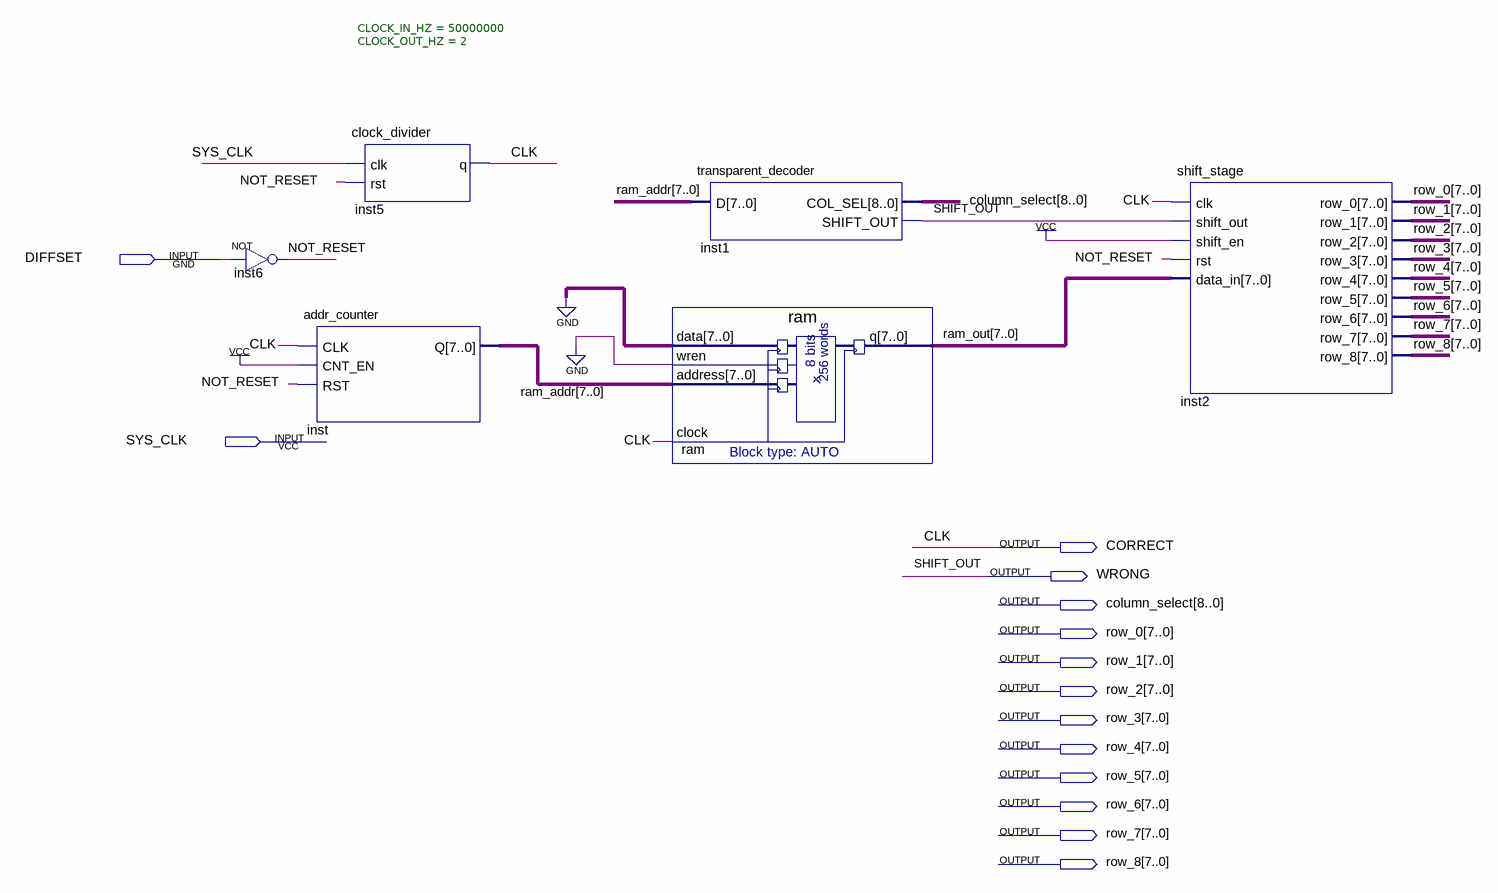
[diagram p0: schematic sheet]
// Quartus schematic test_ram_display.bdf as structural Verilog: 6 symbols, 14 pins
module test_ram_display (
  input  DIFFSET,
  input  SYS_CLK,
  output CORRECT,
  output WRONG,
  output [8:0] column_select,
  output [7:0] row_0,
  output [7:0] row_1,
  output [7:0] row_2,
  output [7:0] row_3,
  output [7:0] row_4,
  output [7:0] row_5,
  output [7:0] row_6,
  output [7:0] row_7,
  output [7:0] row_8
);

  wire NOT_RESET;
  wire [7:0] ram_addr, ram_out;

  not inst6 (NOT_RESET, DIFFSET);
  clock_divider #(.CLOCK_IN_HZ(50000000), .CLOCK_OUT_HZ(2)) inst5 (.clk(SYS_CLK), .rst(NOT_RESET), .q(CORRECT));
  addr_counter inst (.CLK(CORRECT), .CNT_EN(1'b1), .RST(NOT_RESET), .Q(ram_addr));
  transparent_decoder inst1 (.D(ram_addr), .COL_SEL(column_select), .SHIFT_OUT(WRONG));
  ram ram (.data({8{1'b0}}), .wren(1'b0), .address(ram_addr), .clock(CORRECT), .q(ram_out));
  shift_stage inst2 (
    .clk(CORRECT), .shift_out(WRONG), .shift_en(1'b1), .rst(NOT_RESET), .data_in(ram_out), .row_0(row_0),
    .row_1(row_1), .row_2(row_2), .row_3(row_3), .row_4(row_4), .row_5(row_5), .row_6(row_6), .row_7(row_7),
    .row_8(row_8));

  // Other names for the same wires on the sheet: CLK = CORRECT; SHIFT_OUT = WRONG
endmodule
